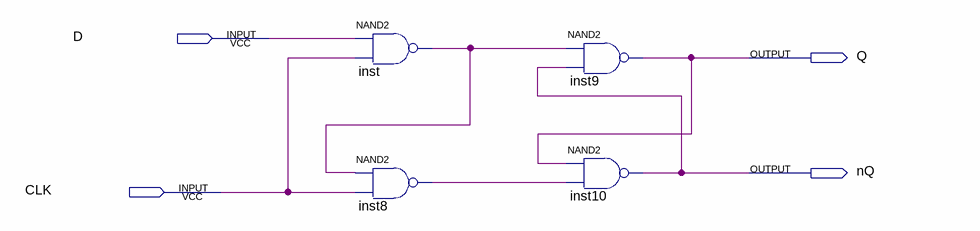
[diagram p0: schematic sheet]
// Quartus schematic D.bdf as structural Verilog: 4 symbols, 4 pins
module D (
  input  D,
  input  CLK,
  output Q,
  output nQ
);

  wire inst8_out, inst_out;

  nand inst (inst_out, D, CLK);
  nand inst8 (inst8_out, inst_out, CLK);
  nand inst9 (Q, inst_out, nQ);
  nand inst10 (nQ, Q, inst8_out);
endmodule
